# EAGLE schematic Official (EAGLE 7.2.0)
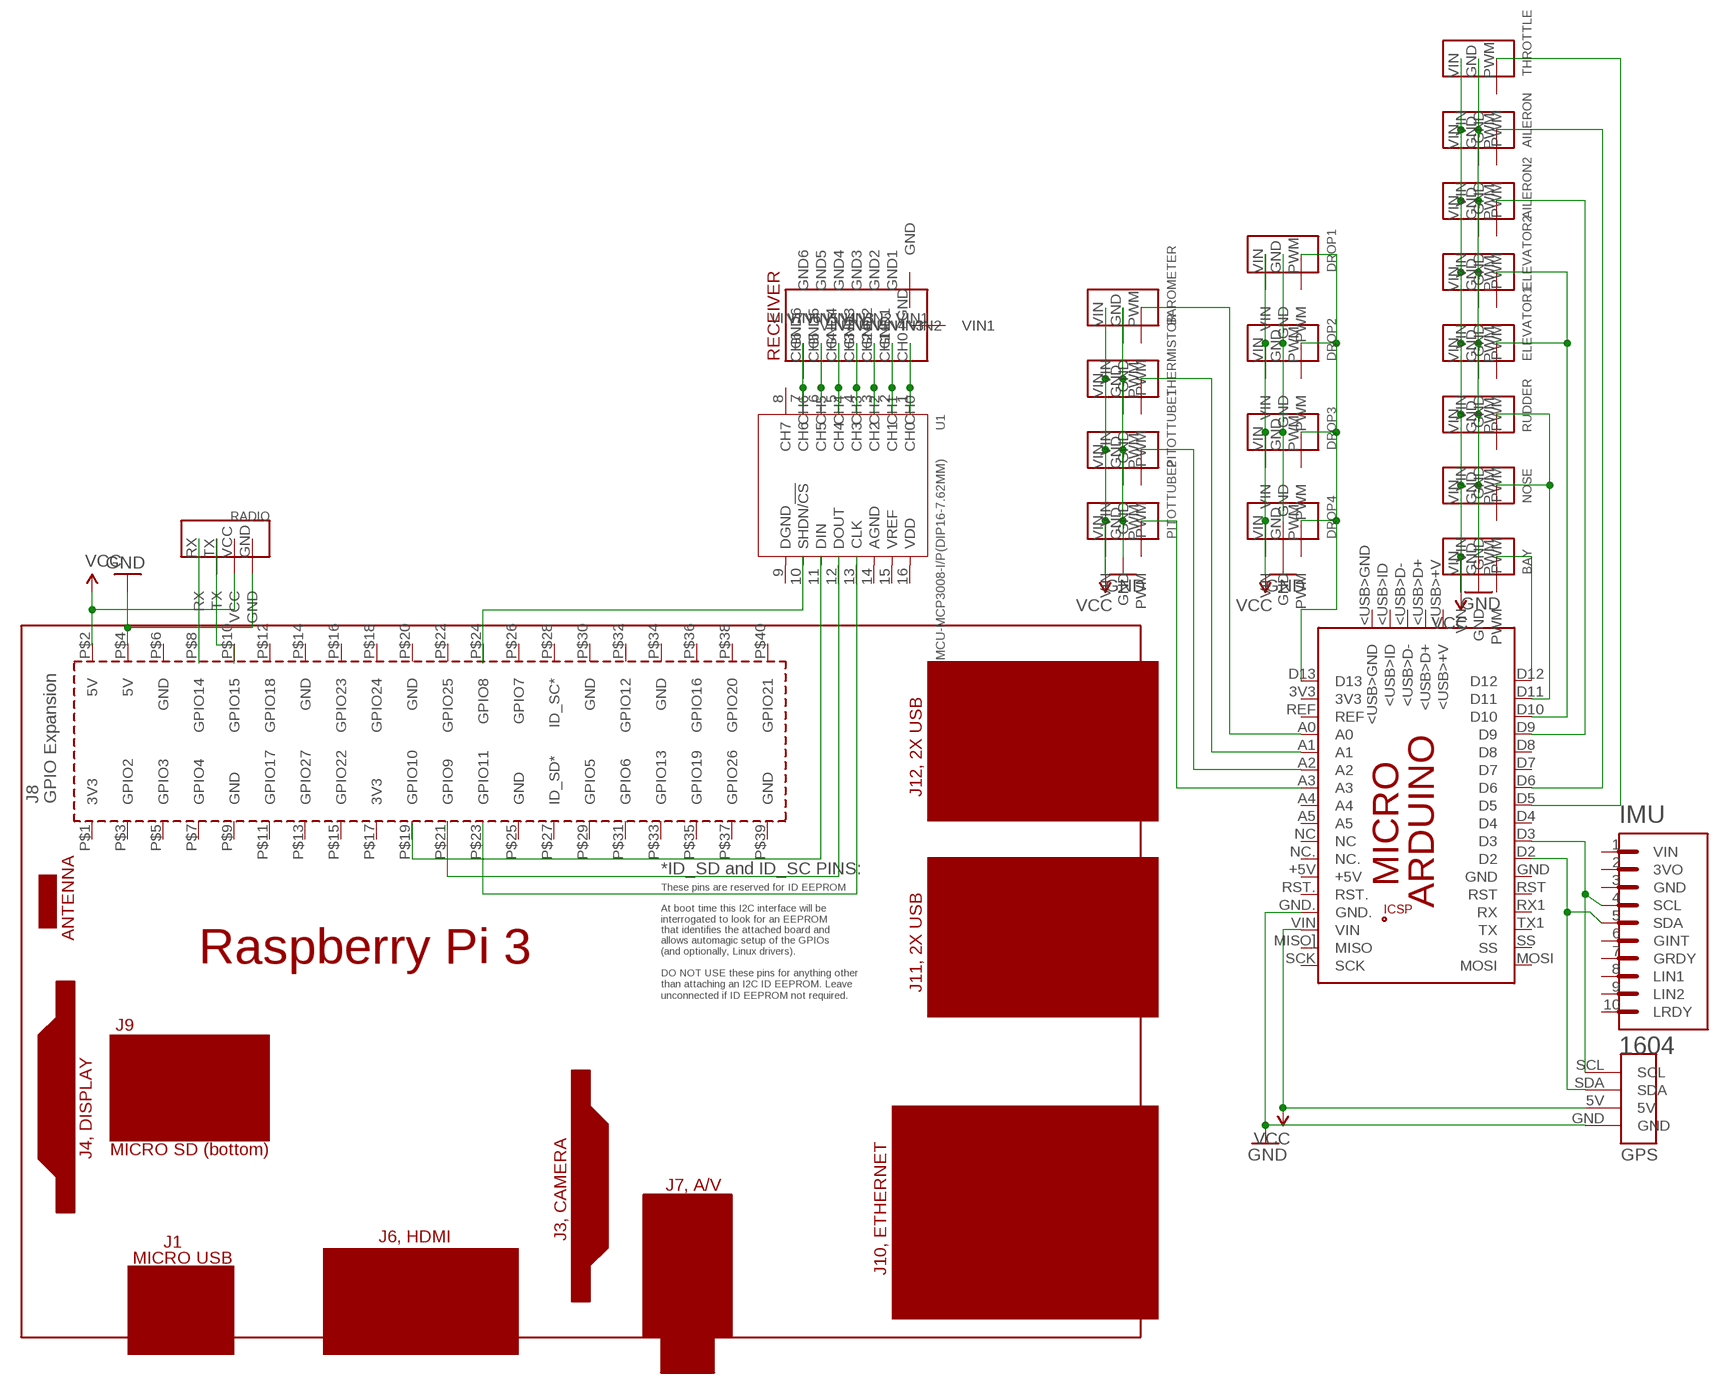
[diagram p0: schematic, sheet 1]

## Parts
AILERON  SERVO  [SERVO]
AILERON2  SERVO  [SERVO]
BAROMETER  Barometer  SERVO  [SERVO]
BAY  SERVO  [SERVO]
DROP1  SERVO  [SERVO]
DROP2  SERVO  [SERVO]
DROP3  SERVO  [SERVO]
DROP4  SERVO  [SERVO]
ELEVATOR1  SERVO  [SERVO]
ELEVATOR2  SERVO  [SERVO]
GPS  GPSPLACEHOLDER  [GPSPLACEHOLDER]
IMU  1604  [ADAFRUIT_1604]
NOSE  SERVO  [SERVO]
PCB1  ARDUINO_MICRO  [ARDUINO_MICRO]
PCB2  RPI3  [RPI3]
PITOTTUBE1  SERVO  [SERVO]
PITOTTUBE2  SERVO  [SERVO]
RADIO  RADIO  [RADIO]
RECEIVER  RECEIVER  [RECEIVER]
RUDDER  SERVO  [SERVO]
THERMISTOR  SERVO  [SERVO]
THROTTLE  SERVO  [SERVO]
U1  MCU-MCP3008-I/P(DIP16-7.62MM)  [DIP16-2.54-19.2X7.62MM]

## Nets
GND: BAROMETER.GND GPS.GND PCB1.GND. PITOTTUBE1.GND PITOTTUBE2.GND THERMISTOR.GND
N$1: RADIO.TX
N$2: RECEIVER.CH6 U1.7(CH6)
N$3: RADIO.RX
N$4: ELEVATOR1.PWM ELEVATOR2.PWM PCB1.D10
N$7: DROP1.GND DROP2.GND DROP3.GND DROP4.GND
N$8: BAY.PWM PCB1.D12
N$9: NOSE.PWM PCB1.D11 RUDDER.PWM
N$10: AILERON2.PWM PCB1.D9
N$11: AILERON.PWM PCB1.D6
N$12: PCB1.D5 THROTTLE.PWM
N$13: GPS.SCL IMU.4(SCL) PCB1.D3
N$14: DROP1.PWM DROP2.PWM DROP3.PWM DROP4.PWM PCB1.D13
N$17: PCB1.A3 PITOTTUBE2.PWM
N$26: RECEIVER.CH5 U1.6(CH5)
N$27: RECEIVER.CH4 U1.5(CH4)
N$28: RECEIVER.CH3 U1.4(CH3)
N$29: RECEIVER.CH2 U1.3(CH2)
N$30: RECEIVER.CH1 U1.2(CH1)
N$31: RECEIVER.CH0 U1.1(CH0)
N$33: PCB1.A2 PITOTTUBE1.PWM
N$34: PCB1.A1 THERMISTOR.PWM
N$35: BAROMETER.PWM PCB1.A0
N$37: AILERON2.GND AILERON.GND BAY.GND ELEVATOR1.GND ELEVATOR2.GND NOSE.GND RUDDER.GND THROTTLE.GND
N$38: GPS.SDA IMU.5(SDA) PCB1.D2
VCC: AILERON2.VIN AILERON.VIN BAROMETER.VIN BAY.VIN DROP1.VIN DROP2.VIN DROP3.VIN DROP4.VIN ELEVATOR1.VIN ELEVATOR2.VIN GPS.5V NOSE.VIN PCB1.VIN PITOTTUBE1.VIN PITOTTUBE2.VIN RUDDER.VIN THERMISTOR.VIN THROTTLE.VIN
Unconnected: IMU.6(GINT) IMU.7(GRDY) IMU.8(LIN1) IMU.9(LIN2) IMU.10(LRDY) PCB1.3V3 PCB1.5V PCB1.+5V PCB1.<USB>+V PCB1.<USB>D+ PCB1.<USB>D- PCB1.<USB>GND PCB1.<USB>ID PCB1.A4 PCB1.A5 PCB1.D4 PCB1.D7 PCB1.D8 PCB1.GND PCB1.GND_ PCB1.MISO. PCB1.MISO](MISO) PCB1.MOSI PCB1.MOSI. PCB1.NC PCB1.NC. PCB1.REF PCB1.RESET.. PCB1.RST PCB1.RST. PCB1.RX1(RX) PCB1.SCK PCB1.SCK. PCB1.SS PCB1.TX1(TX) PCB2.P$1(3V3) PCB2.P$2(5V) PCB2.P$3(GPIO2) PCB2.P$4(5V) PCB2.P$5(GPIO3) PCB2.P$6(GND) PCB2.P$7(GPIO4) PCB2.P$8(GPIO14) PCB2.P$9(GND) PCB2.P$10(GPIO15) PCB2.P$11(GPIO17) PCB2.P$12(GPIO18) PCB2.P$13(GPIO27) PCB2.P$14(GND) PCB2.P$15(GPIO22) PCB2.P$16(GPIO23) PCB2.P$17(3V3) PCB2.P$18(GPIO24) PCB2.P$19(GPIO10) PCB2.P$20(GND) PCB2.P$21(GPIO9) PCB2.P$22(GPIO25) PCB2.P$23(GPIO11) PCB2.P$24(GPIO8) PCB2.P$25(GND) PCB2.P$26(GPIO7) PCB2.P$27(ID_SD*) PCB2.P$28(ID_SC*) PCB2.P$29(GPIO5) PCB2.P$30(GND) PCB2.P$31(GPIO6) PCB2.P$32(GPIO12) PCB2.P$33(GPIO13) PCB2.P$34(GND) PCB2.P$35(GPIO19) PCB2.P$36(GPIO16) PCB2.P$37(GPIO26) PCB2.P$38(GPIO20) PCB2.P$39(GND) PCB2.P$40(GPIO21) RADIO.GND RADIO.VCC RECEIVER.GND RECEIVER.GND1 RECEIVER.GND2 RECEIVER.GND3 RECEIVER.GND4 RECEIVER.GND5 RECEIVER.GND6 RECEIVER.VIN1 RECEIVER.VIN2 RECEIVER.VIN3 RECEIVER.VIN4 RECEIVER.VIN5 RECEIVER.VIN6 RECEIVER.VIN7 U1.8(CH7) U1.9(DGND) U1.10(SHDN/!CS) U1.11(DIN) U1.12(DOUT) U1.13(CLK) U1.14(AGND) U1.15(VREF) U1.16(VDD)

## Power pins joined to a net without a drawn wire
3VO: IMU.2(3VO)
GND: IMU.3(GND)
VIN: IMU.1(VIN)

## Library data of the parts
AILERON AILERON2 BAROMETER BAY DROP1-DROP4 ELEVATOR1 ELEVATOR2 NOSE PITOTTUBE1 PITOTTUBE2 RUDDER THERMISTOR THROTTLE = Servoplaceholder:SERVO
GPS = GPS2:GPSPLACEHOLDER
IMU = IMU:1604: Adafruit 10-DOF IMU Breakout - L3GD20H + LSM303 + BMP180; AVAILABILITY: Bad; DESCRIPTION: Adafruit 10-DOF IMU Breakout - L3GD20H + LSM303 + BMP180; MF: Adafruit Industries; MP: 1604; PACKAGE: None; PRICE: 26.66 USD
PCB1 = E14_Arduino_revC:ARDUINO_MICRO: Device for representing an Arduino Micro board with a footprint in an EAGLE design. Created by Dave Young for Element14. More EAGLE documentation at: http://www.element14.com/community/community/knode/cadsoft_eagle
PCB2 = e14_Rpi3_RevA:RPI3: Device for Raspberry Pi 3 board created by Dave Young for www.element14.com More information and support community is available at https://www.element14.com/community/community/raspberry-pi
RADIO = Radiov1:RADIO
RECEIVER = Receiver:RECEIVER
U1 = MCU-MCP3008-I_P_DIP16-7.62MM_:MCU-MCP3008-I/P(DIP16-7.62MM): 310990040; AVAILABILITY: Good; DESCRIPTION: 8 Channel SPI Serial Interface 2.7 V 10-Bit A/D Converter Through Hole - PDIP-16; MF: Microchip; MP: MCP3008-I/P; PACKAGE: DIP-16 Microchip; PRICE: 2.16 USD